# Altium schematic sheet isolator_si8662.SchDoc
size A
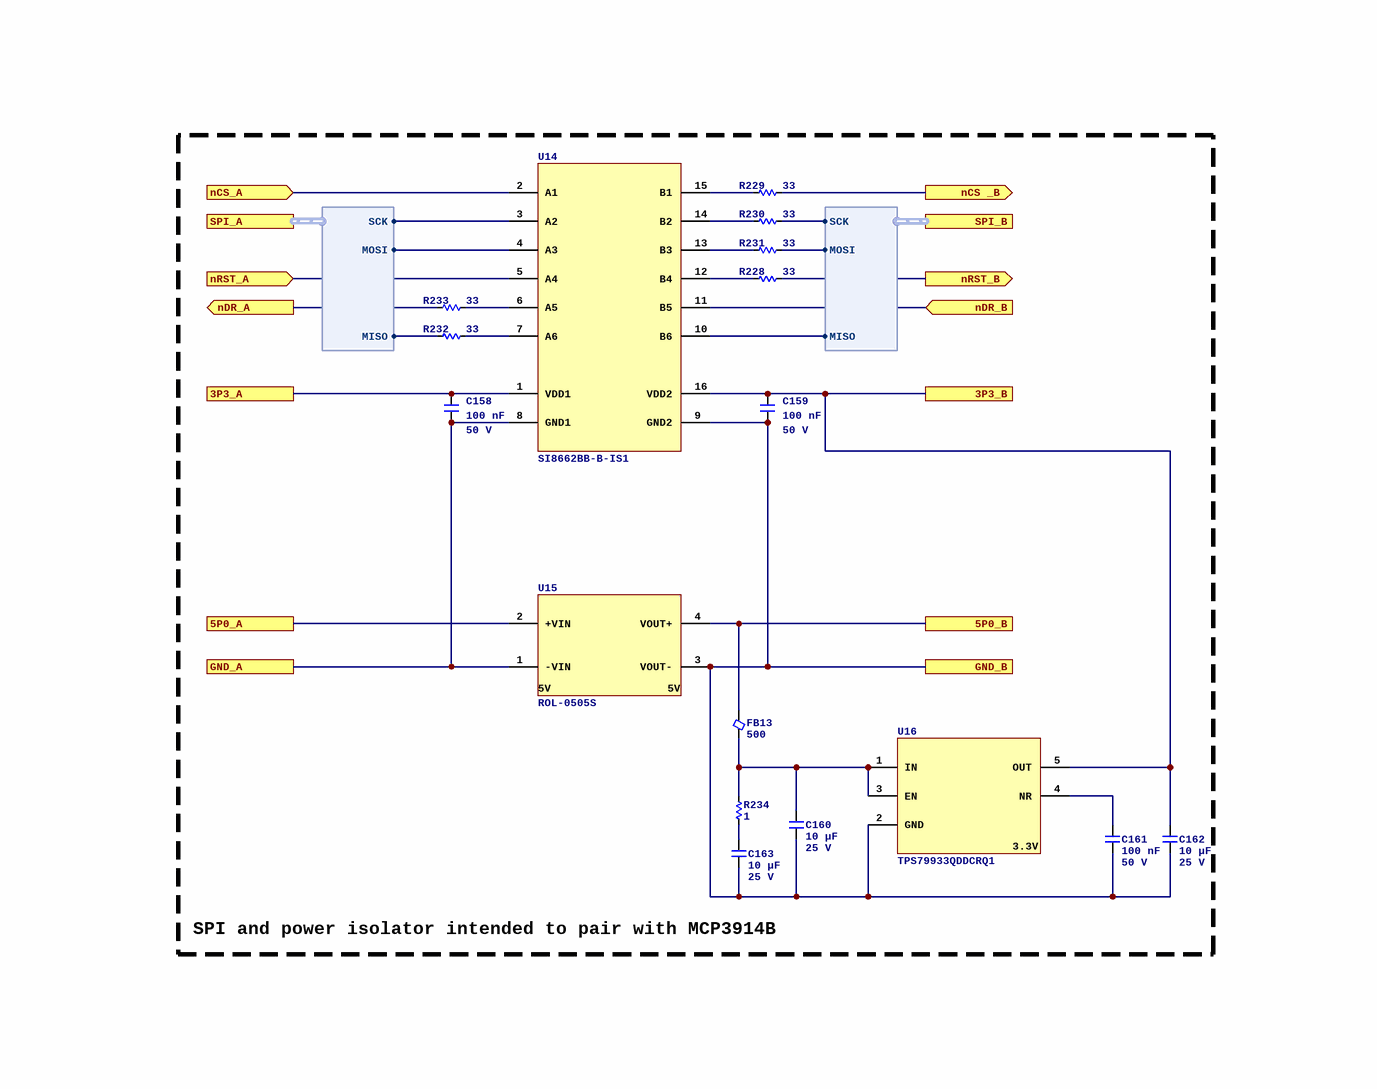
[diagram p0: isolator_si8662.SchDoc]

## Parts
C158  Capacitance: 100 nF  Voltage Rating: 50 V  [C0402]  (hidden comment: CL05B104KB54PNC)
C159  Capacitance: 100 nF  Voltage Rating: 50 V  [C0402]  (hidden comment: CL05B104KB54PNC)
C160  Capacitance: 10 µF  Voltage Rating: 25 V  [C0603]  (hidden comment: CL10A106MA8NRNC)
C161  Capacitance: 100 nF  Voltage Rating: 50 V  [C0402]  (hidden comment: CL05B104KB54PNC)
C162  Capacitance: 10 µF  Voltage Rating: 25 V  [C0805]  (hidden comment: CL21B106KAYQNNE)
C163  Capacitance: 10 µF  Voltage Rating: 25 V  [C0805]  (hidden comment: CL21B106KAYQNNE)
FB13  Current Rating (mA): 500  [FB0402]  (hidden comment: BLM15AX601SN1D)
R228  value 33  [R0402]  (hidden comment: 0402WGF330JTCE)
R229  value 33  [R0402]  (hidden comment: 0402WGF330JTCE)
R230  value 33  [R0402]  (hidden comment: 0402WGF330JTCE)
R231  value 33  [R0402]  (hidden comment: 0402WGF330JTCE)
R232  value 33  [R0402]  (hidden comment: 0402WGF330JTCE)
R233  value 33  [R0402]  (hidden comment: 0402WGF330JTCE)
R234  value 1  [R0402]  (hidden comment: CRCW04021R00FKED)
U14  SI8662BB-B-IS1  [16SOIC150]
U15  ROL-0505S  [4SIP]
U16  TPS79933QDDCRQ1  [5SOT23]

## Blocks framed on the sheet
SPI and power isolator intended to pair with MCP3914B: C158-C163 FB13 R228-R234 U14-U16

## Ports
3P3_A, 3P3_B, 5P0_A, 5P0_B, GND_A, GND_B, nCS _B (out), nCS_A (in), nDR_A (out), nDR_B (in), nRST_A (in), nRST_B (out), SPI_A (harness SPI), SPI_B (harness SPI)

## Harnesses
SPI: MISO, MOSI, SCK

## Nets
3P3_A: C158.1 U14.1(VDD1) ; port 3P3_A
3P3_B: C159.1 C162.1 U14.16(VDD2) U16.5(OUT) ; port 3P3_B
5P0_A: U15.2(+VIN) ; port 5P0_A
5P0_B: FB13.2 U15.4(VOUT+) ; port 5P0_B
GND_A: C158.2 U14.8(GND1) U15.1(-VIN) ; port GND_A
GND_B: C159.2 C160.2 C161.2 C162.2 C163.2 U14.9(GND2) U15.3(VOUT-) U16.2(GND) ; port GND_B
nCS _B: R229.1 ; port nCS _B
nCS_A: U14.2(A1) ; port nCS_A
nDR_A: R233.2 ; port nDR_A
nDR_B: U14.11(B5) ; port nDR_B
nRST_A: U14.5(A4) ; port nRST_A
nRST_B: R228.1 ; port nRST_B
NetC160_1: C160.1 FB13.1 R234.2 U16.1(IN) U16.3(EN)
NetC161_1: C161.1 U16.4(NR)
NetC163_1: C163.1 R234.1
NetR228_2: R228.2 U14.12(B4)
NetR229_2: R229.2 U14.15(B1)
NetR230_1: R230.1 ; port SPI_B.SCK
NetR230_2: R230.2 U14.14(B2)
NetR231_1: R231.1 ; port SPI_B.MOSI
NetR231_2: R231.2 U14.13(B3)
NetR232_1: R232.1 U14.7(A6)
NetR232_2: R232.2 ; port SPI_A.MISO
NetR233_1: R233.1 U14.6(A5)
NetU14_3: U14.3(A2) ; port SPI_A.SCK
NetU14_4: U14.4(A3) ; port SPI_A.MOSI
NetU14_10: U14.10(B6) ; port SPI_B.MISO

## Notes on the sheet
- (in symbol ROL-0505S) 5V
- (in symbol TPS79933QDDCRQ1) 3.3V

## Library data of the parts
C158 C159 C161 = CL05B104KB54PNC: Manufacturer: Samsung Electro-Mechanics; Dielectric: X7R; ComponentLink1URL: https://wmsc.lcsc.com/wmsc/upload/file/pdf/v2/lcsc/2304140030_Samsung-Electro-Mechanics-CL05B104KB54PNC_C307331.pdf; ComponentLink1Description: Datasheet; Manufacturer Part Number: CL05B104KB54PNC; Package: 0402; Supplier 2: LCSC; Supplier Part Number 2: C307331
C160 = CL10A106MA8NRNC: Manufacturer: Samsung Electro-Mechanics; Dielectric: X5R; ComponentLink1URL: https://wmsc.lcsc.com/wmsc/upload/file/pdf/v2/lcsc/2304140030_Samsung-Electro-Mechanics-CL10A106MA8NRNC_C96446.pdf; ComponentLink1Description: Datasheet; Manufacturer Part Number: CL10A106MA8NRNC; Package: 0603; Supplier 2: LCSC; Supplier Part Number 2: C96446
C162 C163 = CL21B106KAYQNNE: Manufacturer: Samsung Electro-Mechanics; Dielectric: X7R; ComponentLink1URL: https://datasheet.lcsc.com/lcsc/2206222030_Samsung-Electro-Mechanics-CL21B106KAYQNNE_C3039694.pdf; ComponentLink1Description: Datasheet; Manufacturer Part Number: CL21B106KAYQNNE; Package: 0805; Supplier 2: LCSC; Supplier Part Number 2: C3039694
FB13 = BLM15AX601SN1D: Manufacturer: Murata Electronics; Z @ 100 MHz: 600; DCR (mOhms): 340; ComponentLink1URL: https://wmsc.lcsc.com/wmsc/upload/file/pdf/v2/lcsc/2304140030_Murata-Electronics-BLM15AX601SN1D_C76886.pdf; ComponentLink1Description: Datasheet; Manufacturer Part Number: BLM15AX601SN1D; Supplier 2: LCSC; Supplier Part Number 2: C76886; Package: 0402
R228-R233 = 0402WGF330JTCE: Manufacturer: UNI-ROYAL(Uniroyal Elec); Tolerance: 1%; Temperature Coefficient: ±100ppm/?; Power Rating (mW): 62.5; ComponentLink1Description: Datasheet; ComponentLink1URL: https://wmsc.lcsc.com/wmsc/upload/file/pdf/v2/lcsc/2205311900_UNI-ROYAL-Uniroyal-Elec-0402WGF330JTCE_C25105.pdf; Manufacturer Part Number: 0402WGF330JTCE; Package: 0402; Supplier 2: LCSC; Supplier Part Number 2: C25105
R234 = CRCW04021R00FKED: Manufacturer: Vishay Intertech; Tolerance: 1%; Temperature Coefficient: ±100ppm/?; Power Rating (mW): 63; ComponentLink1Description: Datasheet; ComponentLink1URL: https://wmsc.lcsc.com/wmsc/upload/file/pdf/v2/lcsc/2211030200_Vishay-Intertech-CRCW04021R00FKED_C482087.pdf; Manufacturer Part Number: CRCW04021R00FKED; Package: 0402; Supplier 2: LCSC; Supplier Part Number 2: C482087
U14 = SI8662BB-B-IS1: 6-ch 2.5kV Isolator, 150M, 4/2, NB SOIC16, lead free; Manufacturer: Skyworks Solutions; Supplier 1: DigiKey; Supplier Part Number 1: SI8662BB-B-IS1-ND; Manufacturer Part Number: SI8662BB-B-IS1; Supplier 2: LCSC; Supplier Part Number 2: C430287; ComponentLink1Description: Datasheet; ComponentLink1URL: https://www.skyworksinc.com/-/media/Skyworks/SL/documents/public/data-sheets/Si866x.pdf; Supplier 3: Mouser; Supplier Part Number 3: 634-SI8662BB-B-IS1
U15 = ROL-0505S: 5V to 5V isolated power supply module; Manufacturer: Recom; Supplier 1: DigiKey; Supplier Part Number 1: 945-1949-5-ND; Manufacturer Part Number: ROL-0505S; ComponentLink1Description: Datasheet; ComponentLink1URL: https://recom-power.com/pdf/Econoline/ROL.pdf; Supplier 2: LCSC; Supplier Part Number 2: C22372006
U16 = TPS79933QDDCRQ1: Fixed Positive LDO Regulator, 3.3V, 0.16V Dropout, BICMOS, PDSO5; Manufacturer: Texas Instruments; Supplier 1: DigiKey; Supplier Part Number 1: 296-24852-1-ND; Manufacturer Part Number: TPS79933QDDCRQ1; ComponentLink1Description: Datasheet; ComponentLink1URL: https://www.ti.com/lit/ds/symlink/tps799-q1.pdf; Supplier 2: LCSC; Supplier Part Number 2: C2865613; Supplier 3: Mouser; Supplier Part Number 3: 595-TPS79933QDDCRQ1